# Altium project STM32_Altium.PrjPcb
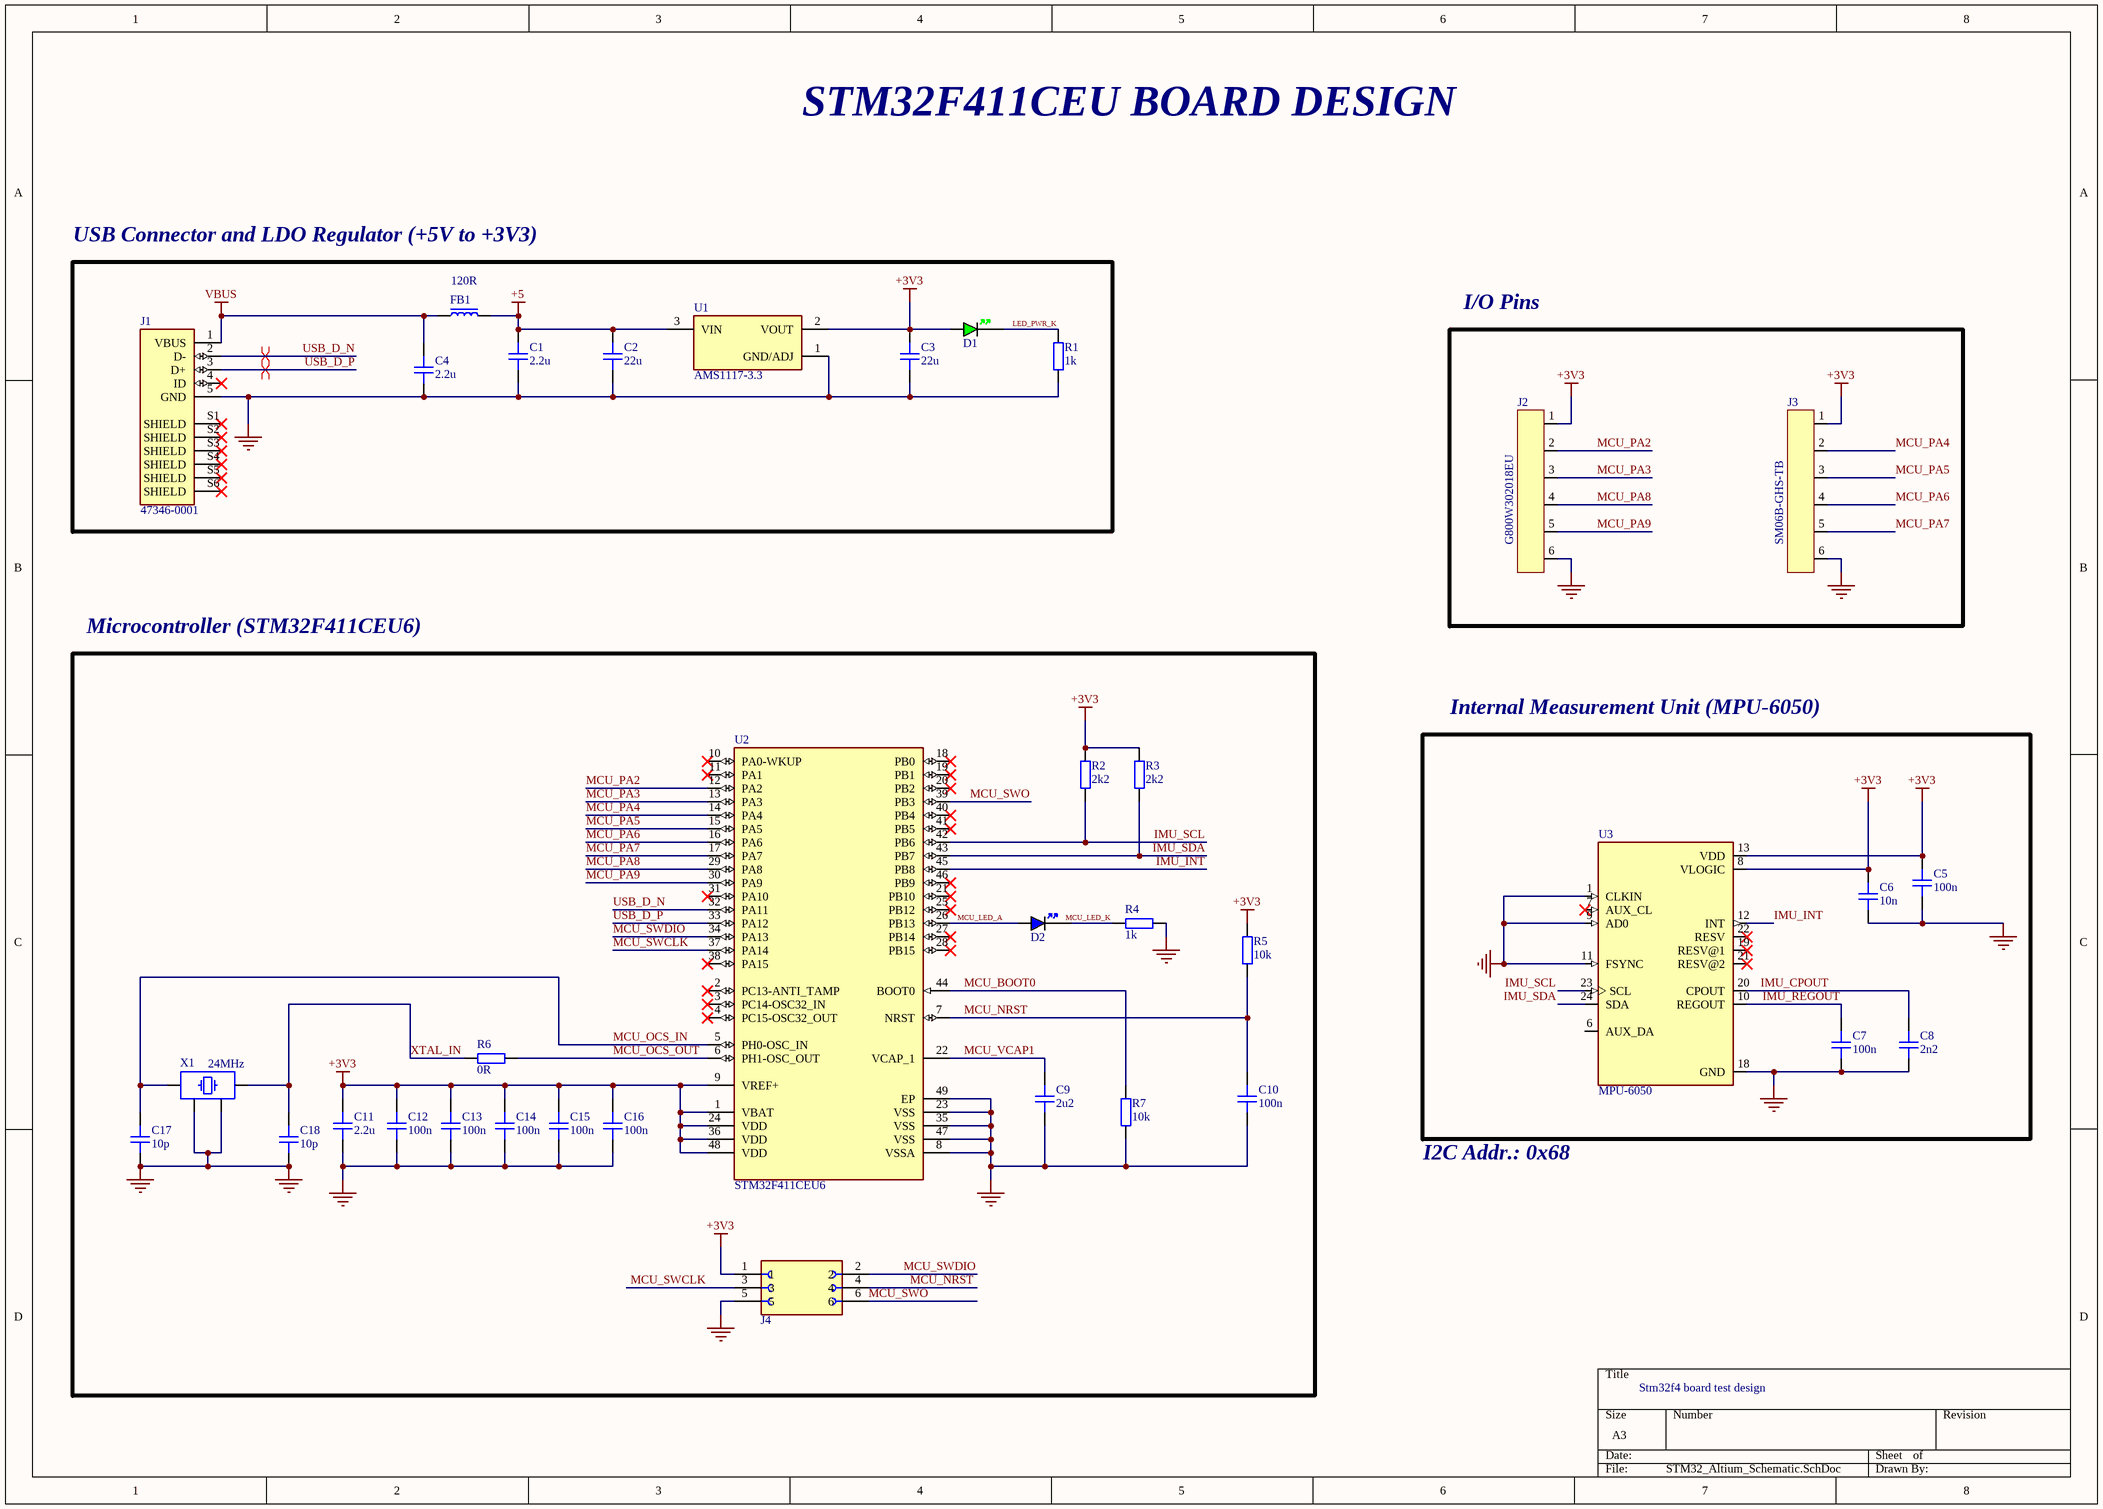
[diagram p0: STM32_Altium_Schematic.SchDoc]
1 sheet, 36 parts. Net scope: global (net labels, ports and power ports of the same name join across sheets).
Board file: STM32_Altium_PCB.PcbDoc

## Sheet STM32_Altium_Schematic.SchDoc
size A3; SheetNumber: 1; SheetTotal: 1

### Parts
C1  2.2u  [CAP_0603]
C2  22u  [CAP_0805]
C3  22u  [CAP_0805]
C4  2.2u  [CAP_0603]
C5  100n  [CAP_0402]
C6  10n  [CAP_0402]
C7  100n  [CAP_0402]
C8  2n2  [CAP_0402]
C9  2u2  [CAP_0603]
C10  100n  [CAP_0402]
C11  2.2u  [CAP_0603]
C12  100n  [CAP_0402]
C13  100n  [CAP_0402]
C14  100n  [CAP_0402]
C15  100n  [CAP_0402]
C16  100n  [CAP_0402]
C17  10p  [CAP_0402]
C18  10p  [CAP_0402]
D1  GREEN  [LED_0805_GREEN]  (value not drawn)
D2  BLUE  [LED_0402_BLUE]  (value not drawn)
FB1  120R  [FB_0603]
J1  47346-0001  [MOLEX_47346-0001]
J2  G800W302018EU  [G800W302018EU]
J3  SM06B-GHS-TB  [SM06B-GHS-TB]
J4  PPTC032LFBN-RC  [PPTC032LFBN-RC]  (value not drawn)
R1  1k  [RES_0402]
R2  2k2  [RES_0402]
R3  2k2  [RES_0402]
R4  1k  [RES_0402]
R5  10k  [RES_0402]
R6  0R  [RES_0402]
R7  10k  [RES_0402]
U1  AMS1117-3.3  [SOT229P700X180-4N]
U2  STM32F411CEU6  [QFN50P700X700X60-49N]
U3  MPU-6050  [QFN50P400X400X95-24N]
X1  24MHz  [XTAL_3225]

### Blocks framed on the sheet
USB Connector and LDO Regulator (+5V to +3V3): C1-C4 D1 FB1 J1 R1 U1
I/O Pins: J2 J3
Microcontroller (STM32F411CEU6): C9-C18 D2 J4 R2-R7 U2 X1
Internal Measurement Unit (MPU-6050): C5-C8 U3

### Nets
+3V3: C3.2 C5.2 C6.2 C11.2 C12.2 C13.2 C14.2 C15.2 C16.2 D1.A J2.1 J3.1 J4.1 R2.2 R3.2 R5.2 U1.2(VOUT) U2.1(VBAT) U2.9(VREF+) U2.24(VDD) U2.36(VDD) U2.48(VDD) U3.8(VLOGIC) U3.13(VDD)
+5: C1.2 C2.2 FB1.2 U1.3(VIN)
GND: C1.1 C2.1 C3.1 C4.1 C5.1 C6.1 C7.2 C8.2 C9.1 C10.1 C11.1 C12.1 C13.1 C14.1 C15.1 C16.1 C17.2 C18.1 J1.5(GND) J2.6 J3.6 J4.5 R1.2 R4.2 R7.1 U1.1(GND/ADJ) U2.8(VSSA) U2.23(VSS) U2.35(VSS) U2.47(VSS) U2.49(EP) U3.1(CLKIN) U3.9(AD0) U3.11(FSYNC) U3.18(GND) X1.2 X1.4
VBUS: C4.2 FB1.1 J1.1(VBUS)
IMU_CPOUT: C8.1 U3.20(CPOUT)
IMU_INT: U2.45(PB8) U3.12(INT)
IMU_REGOUT: C7.1 U3.10(REGOUT)
IMU_SCL: R2.1 U2.42(PB6) U3.23(SCL)
IMU_SDA: R3.1 U2.43(PB7) U3.24(SDA)
LED_PWR_K: D1.K R1.1
MCU_BOOT0: R7.2 U2.44(BOOT0)
MCU_LED_A: D2.A U2.26(PB13)
MCU_LED_K: D2.K R4.1
MCU_NRST: C10.2 J4.4 R5.1 U2.7(NRST)
MCU_OCS_IN: C17.1 U2.5(PH0-OSC_IN) X1.1
MCU_OCS_OUT: R6.2 U2.6(PH1-OSC_OUT)
MCU_PA2: J2.2 U2.12(PA2)
MCU_PA3: J2.3 U2.13(PA3)
MCU_PA4: J3.2 U2.14(PA4)
MCU_PA5: J3.3 U2.15(PA5)
MCU_PA6: J3.4 U2.16(PA6)
MCU_PA7: J3.5 U2.17(PA7)
MCU_PA8: J2.4 U2.29(PA8)
MCU_PA9: J2.5 U2.30(PA9)
MCU_SWCLK: J4.3 U2.37(PA14)
MCU_SWDIO: J4.2 U2.34(PA13)
MCU_SWO: J4.6 U2.39(PB3)
MCU_VCAP1: C9.2 U2.22(VCAP_1)
USB_D_N: J1.2(D-) U2.32(PA11)
USB_D_P: J1.3(D+) U2.33(PA12)
XTAL_IN: C18.2 R6.1 X1.3

Not connected (* = marked no-connect by the designer): J1 4(ID)* S1(SHIELD)* S2(SHIELD)* S3(SHIELD)* S4(SHIELD)* S5(SHIELD)* S6(SHIELD)*; U2 2(PC13-ANTI_TAMP)* 3(PC14-OSC32_IN)* 4(PC15-OSC32_OUT)* 10(PA0-WKUP)* 11(PA1)* 18(PB0)* 19(PB1)* 20(PB2)* 21(PB10)* 25(PB12)* 27(PB14)* 28(PB15)* 31(PA10)* 38(PA15)* 40(PB4)* 41(PB5)* 46(PB9)*; U3 6(AUX_DA) 7(AUX_CL)* 19(RESV@1)* 21(RESV@2)* 22(RESV)*

### Layout directives
differential pair; differential pair class DIFF_USB: USB_D_N, USB_D_P

### Notes on the sheet
- STM32F411CEU BOARD DESIGN
- I2C Addr.: 0x68
- Stm32f4 board test design

### Library data of the parts
C1 C4 C9 C11 = CAP_0603_16V: Capacitor SMD 0603 16V
C2 C3 = CAP_0805_16V: Capacitor SMD 0805 16V
C5-C8 C10 C12-C18 = CAP_0402_16V: Capacitor SMD 0402 16V
D1 = LED_0805_GREEN: LED 0805 GREEN SMD; Manufacturer: *; Manufacturer Part Number: *; Distributor Link: *; LCSC: *
D2 = LED_0402_BLUE: LED 0402 BLUE SMD
FB1 = FB_0603: Ferrite Bead SMD 0603
J1 = 47346-0001: USB - micro B USB 2.0 Receptacle Connector 5 Position Surface Mount, Right Angle; MF: Molex; SnapEDA_Link: https://www.snapeda.com/parts/47346-0001/Molex/view-part/?ref=snap; Package: None; MP: 47346-0001; Check_prices: https://www.snapeda.com/parts/47346-0001/Molex/view-part/?ref=eda; Purchase-URL: https://pricing.snapeda.com/search/part/47346-0001/?ref=eda; Price: None; Value: *; Availability: In Stock
J2 = G800W302018EU: Pin Header 6 Position 2.54mm Pitch; Manufacturer: Amphenol; Manufacturer Part Number: G800W302018EU
J3 = SM06B-GHS-TB: Header Connector 6 Position 1.25MM Pitch SMD Horizontal JST GH; Manufacturer: JST; Manufacturer Part Number: SM06B-GHS-TB
J4 = PPTC032LFBN-RC: 2x3 female header
R1-R7 = RES_0402: Resistor SMD 0402; Manufacturer: *; Manufacturer Part Number: *; Distributor Link: *
U3 = MPU-6050: MPU-6050 series Accelerometer, Gyroscope, 3 Axis Sensor Evaluation Board; MF: TDK InvenSense; Value: *; SnapEDA_Link: https://www.snapeda.com/parts/MPU-6050/TDK+InvenSense/view-part/?ref=snap; Purchase-URL: https://pricing.snapeda.com/search/part/MPU-6050/?ref=eda; Availability: In Stock; Price: None; Package: QFN-24 InvenSense; Check_prices: https://www.snapeda.com/parts/MPU-6050/TDK+InvenSense/view-part/?ref=eda; MP: MPU-6050
X1 = TSX-3225_24.0000MF15X-AC: Crystal SMD 24MHz 10PPM 7pF 3225; Manufacturer: Epson; Manufacturer Part Number: TSX-3225 24.0000MF15X-AC